# Altium project Nixie_Tube_Clock_Rev1.PrjPcb
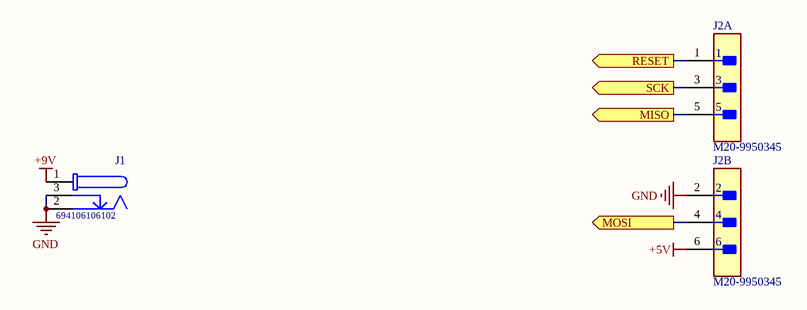
[diagram p0: Connectors.SchDoc]
6 sheets, 63 parts. Net scope: flat (ports and power ports of the same name join across sheets).
Board file: HV_Boost.PcbDoc
Sheets:
  Connectors.SchDoc
  LTC3862-2.SchDoc
  IN_12A.SchDoc
  ATMega1284p.SchDoc
  TPS5402.SchDoc
  Buttons.SchDoc

## Sheet Connectors.SchDoc
size A; SheetNumber: 1; SheetTotal: 6

### Parts
J1  694106106102  [694106106102]
J2  M20-9950345  [FP-M20-9950345-MFG]  (parts A,B of 2)

### Ports
MISO (out), MOSI (out), RESET (out), SCK (out)

### Nets
+5V: J2.6
+9V: J1.1
GND: J1.2 J1.3 J2.2
NetJ2_1: J2.1 ; port RESET
NetJ2_3: J2.3 ; port SCK
NetJ2_4: J2.4 ; port MOSI
NetJ2_5: J2.5 ; port MISO

### Library data of the parts
J1 = CMP-1502-00177-1: DC Power Jack Connector with 4 soldering pads & Pegs WR-DC, Male, Right Angled, SMT, 5 A, 24 V; Manufacturer: Wurth Elektronik; Working Voltage: 24V; Rated Current: 5A; Plug Inner Diameter: 2.05mm; Plug Outer Diameter: 5.5mm; Opening Diameter: 6.4mm; Packaging: TapeandReel; Package Reference: 694106106102; Datasheet URL: http://katalog.we-online.de/em/datasheet/6941xx106102.pdf; Operating Temperature: -40to85degC; Orientation: RightAngled; Part Number: 694106106102; Mounting Technology: SMT; Publisher: WurthElektronik; Manufacturer URL: http://www.we-online.de; Gender: Male
J2 = CMP-15831-000002-1: CONN HEADER R/A 6POS 2.54MM; Manufacturer: Harwin; Conn Gender: Male; Number Of Contacts: 6; Conn Orientation: Right Angle; Current Rating: 3A; Description: 6 Positions Header, Unshrouded, Breakaway Connector 0.100" (2.54mm) Through Hole, Right Angle Gold; Device Class L2: Headers and Wire Housings; Temperature: -40°C to +105°C; Device Class L1: Connectors; RoHS: TRUE; Temperature Range Low: -40°C; ComponentLink2URL: https://cdn.harwin.com/pdfs/M20-995.pdf; Height: 5.28mm; Digikey Description: CONN HEADER R/A 6POS 2.54MM; Pitch: 2.54mm; Manufacturer Part Number: M20-9950345; Device Class L3: unset; Ipc Land Pattern Name: DFN400X400X80-14; Automotive: No; Octopart: https://octopart.com/m20-9950345-harwin-21265213; Category: Conn; Mouser Description: Headers & Wire Housings 03+03 DIL HORIZONTAL PIN HEADER GOLD HT; Package: 0; Number Of Rows: 2; Contact Material: Gold,Nickel; Lead Free: Yes; ComponentLink2Description: Datasheet; Temperature Range High: +105°C

## Sheet LTC3862-2.SchDoc
size 431 x 279 mm; SheetNumber: 2; SheetTotal: 4
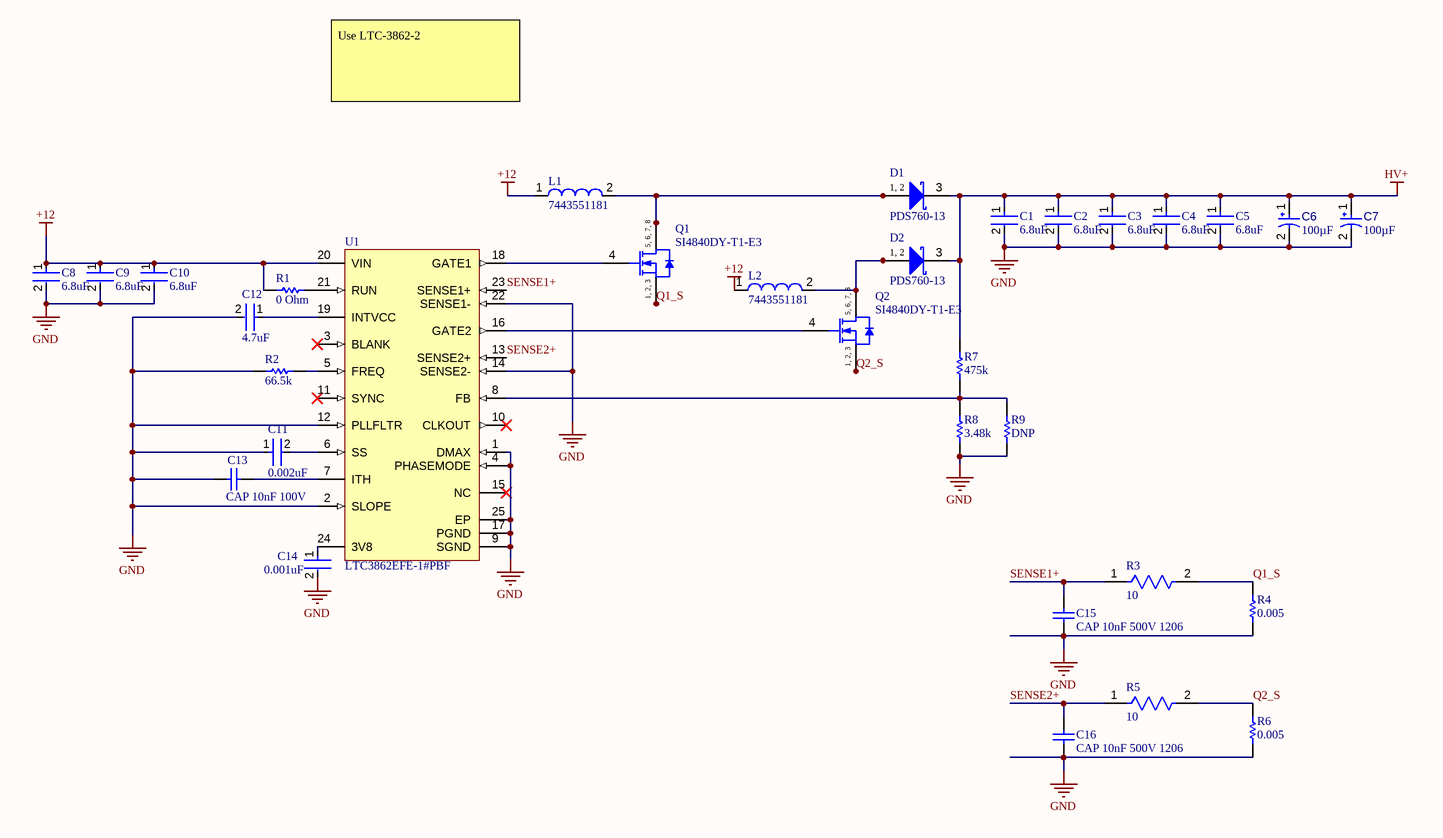
[diagram p1: LTC3862-2.SchDoc]

### Parts
C1  6.8uF  [FP-C3216-160-0_2-MFG]
C2  6.8uF  [FP-C3216-160-0_2-MFG]
C3  6.8uF  [FP-C3216-160-0_2-MFG]
C4  6.8uF  [FP-C3216-160-0_2-MFG]
C5  6.8uF  [FP-C3216-160-0_2-MFG]
C6  value 100µF  [CAPPR65-500-1600X1000X1700]  (hidden comment: ECA-2DM101)
C7  value 100µF  [CAPPR65-500-1600X1000X1700]  (hidden comment: ECA-2DM101)
C8  6.8uF  [FP-C3216-160-0_2-IPC_B]
C9  6.8uF  [FP-C3216-160-0_2-IPC_B]
C10  6.8uF  [FP-C3216-160-0_2-IPC_B]
C11  0.002uF  [FP-C1206C-EB-MFG]
C12  4.7uF  [FP-GRM31C-0_2-e0_3_0_8-IPC_C]
C13  CAP 10nF 100V  [CAPC1206(3216)170_N]
C14  0.001uF  [FP-C1206C-EB-MFG]
C15  CAP 10nF 500V 1206  [CAPC1206(3216)170_N]
C16  CAP 10nF 500V 1206  [CAPC1206(3216)170_N]
D1  PDS760-13  [DIOD-POWERDI5-3_V]
D2  PDS760-13  [DIOD-POWERDI5-3_V]
L1  7443551181  [WE-HCI-1365]
L2  7443551181  [WE-HCI-1365]
Q1  SI4840DY-T1-E3  [VISH-SOIC-8_A_V]
Q2  SI4840DY-T1-E3  [VISH-SOIC-8_A_V]
R1  0 Ohm  [RESC3216X89X64LL25T25]
R2  66.5k  [RESC3216X70X50NL05T20]
R3  10  [FP-CRCW1206-e3-IPC_A]
R4  0.005  [RESC3216X89X64LL25T25]
R5  10  [FP-CRCW1206-e3-IPC_A]
R6  0.005  [RESC3216X89X64LL25T25]
R7  475k  [RESC3216X60X45LL10T20]
R8  3.48k  [RESC3216X70X50LL05T20]
R9  DNP  [RESC3216X70X50LL05T20]
U1  LTC3862EFE-1#PBF  [LT-FE-24-EPV-AA_M]

### Nets
+12: C8.1 C9.1 C10.1 L1.1 L2.1 R1.1 U1.20(VIN)
GND: C1.2 C2.2 C3.2 C4.2 C5.2 C6.2 C7.2 C8.2 C9.2 C10.2 C11.1 C12.2 C13.2 C14.2 C15.2 C16.2 R2.1 R4.1 R6.1 R8.1 R9.1 U1.1(DMAX) U1.2(SLOPE) U1.4(PHASEMODE) U1.9(SGND) U1.12(PLLFLTR) U1.14(SENSE2-) U1.17(PGND) U1.22(SENSE1-) U1.25(EP)
HV+: C1.1 C2.1 C3.1 C4.1 C5.1 C6.1 C7.1 D1.3(K) D2.3(K) R7.2
Q1_S: Q1.1(S) Q1.2(S) Q1.3(S) R3.2 R4.2
Q2_S: Q2.1(S) Q2.2(S) Q2.3(S) R5.2 R6.2
SENSE1+: C15.1 R3.1 U1.23(SENSE1+)
SENSE2+: C16.1 R5.1 U1.13(SENSE2+)
NetC11_2: C11.2 U1.6(SS)
NetC12_1: C12.1 U1.19(INTVCC)
NetC13_1: C13.1 U1.7(ITH)
NetC14_1: C14.1 U1.24(3V8)
NetD1_1: D1.1(A) D1.2(A) L1.2 Q1.5(D) Q1.6(D) Q1.7(D) Q1.8(D)
NetD2_1: D2.1(A) D2.2(A) L2.2 Q2.5(D) Q2.6(D) Q2.7(D) Q2.8(D)
NetQ1_4: Q1.4(G) U1.18(GATE1)
NetQ2_4: Q2.4(G) U1.16(GATE2)
NetR1_2: R1.2 U1.21(RUN)
NetR2_2: R2.2 U1.5(FREQ)
NetR7_1: R7.1 R8.2 R9.2 U1.8(FB)

Not connected (* = marked no-connect by the designer): U1 3(BLANK)* 10(CLKOUT)* 11(SYNC)* 15(NC)*

### Notes on the sheet
- Use LTC-3862-2
- DWG. NO.
- REV.
- SHT.
- THIS DOCUMENT AND THE DATA DISCLOSED HEREIN OR HEREWITH IS THE PROPERTY OF ALTIUM LIMITED AND MAY BE FREELY DISTRIBUTED IN WHOLE. NO RIGHTS ARE RESERVED OR EXPRESS OR IMPLIED WARANTEE GIVEN.
- REVISION
- DESCRIPTION
- DATE
- APPROVED
- ENG:
- APPROVALS
- PROJECT
- DSN:
- CHK:
- REFERENCE DOCUMENTS
- PROJECT REVISION:
- TITLE
- DOCUMENT REVISION:
- DESIGN ITEM:
- BOM:
- FAB DWG:
- PCB DWG:
- ASSY DWG:
- SCALE:
- SIZE
- B
- CAGE CODE
- FILE NAME
- DWG NO.
- SHEET
- OF
- REV
- (in symbol CMP-2000-07056-1) 5, 6, 7, 8; 1, 2, 3
- (in symbol CMP-2000-07476-1) 1, 2

### Library data of the parts
C1-C5 = CMP-08246-003319-1: Multilayer Ceramic Capacitors 6.8uF ±20% 50V X5R SMD 1206 / C3216X5R1H685M160AB; Max Operating Temperature: 85°C; Min Operating Temperature: -55°C; Resistor Type: Ceramic; Thickness: 0.071inch; Capacitance: 6.8uF; Voltage Rating (DC): 50V; Length: 3.2mm; RoHS Compliant: Yes; Case/Package: 1206; Case Code (Metric): 3216; Series: C; Termination: SMD/SMT; Package Quantity: 1; Dielectric Material: Ceramic; Depth: 1.6mm; Mount: Surface Mount; Height: 1.6mm; Dielectric: X5R; Weight: 0.000571oz; Packaging: Tape and Reel; Lead Free: Lead Free; Tolerance: 20%; Construction: Flat; Width: 0.063inch; Case Code (Imperial): 1206; Voltage Rating: 50V
C6 C7 = CMP-001-00034-5: Aluminum Electrolytic Capacitor, 100 uF, +/- 20%, 200 V, -40 to 85 degC, 2-Pin THD, RoHS, Bulk; Manufacturer: Panasonic; Voltage Rating: 100V; Ripple Current (AC): 350mA; Mounting Technology: TH; RoHS Compliant: True; Package Reference: CAPPR65-500-1600X1000X1700; Lead Pitch: 5mm; Manufacturer URL: http://www.panasonic.com/; Min Operating Temperature: -40°C; Package Quantity: 200; Capacitor Type: Electrolytic; Diameter: 10mm; Packaging: Bulk; Datasheet URL: https://industrial.panasonic.com/cdbs/www-data/pdf/RDF0000/ABA0000C1047.pdf; Max Operating Temperature: 85°C; Pins: 2; Case/Package: Radial; Package Description: 2-Pin Through Hole Device, Dia 10 mm, Body Length 16 mm; Ripple Current: 350mA; Tolerance: 20%; Datasheet Version: Mar-16
C8-C10 = CMP-08246-003250-1: Multilayer Ceramic Capacitors 6.8uF ±10% 25V X7R SMD 1206 / C3216X7R1E685K160AB; Series: C; Construction: Flat; Max Operating Temperature: 125°C; Height: 1.6mm; Depth: 1.6mm; REACH SVHC: No SVHC; Lead Free: Lead Free; Dielectric Material: Ceramic; Length: 3.2mm; Dielectric: X7R; RoHS Compliant: Yes; Package Quantity: 1; Number of Pins: 2; Termination: SMD/SMT; Capacitance: 6.8uF; Min Operating Temperature: -55°C; Voltage Rating: 25V; Tolerance: 10%; Width: 0.063inch; Case Code (Imperial): 1206; Mount: Surface Mount; Resistor Type: Ceramic; Packaging: Tape and Reel; Weight: 0.000571oz; Voltage Rating (DC): 25V; Case/Package: 1206; Thickness: 0.075inch; Case Code (Metric): 3216
C11 = CMP-1037-02760-2: C1206 2,000 pF C0G 5.00% 100 V / C1206C202J1GACTU; Manufacturer: KEMET; Voltage Rating: 100 V; Tolerance: 0.05; Temperature Coefficient: 15%; Material: Ceramic; Automotive Grade: Grade 0; ComponentLink2URL: https://content.kemet.com/datasheets/KEM_C1007_X8R_ULTRA_150C_SMD.pdf; Device Class L3: Ceramic Capacitors; Temperature Characteristic: C0G; Category: Cap; RoHS: TRUE; Mouser Description: Cap Ceramic 0.002uF 100V C0G 5% SMD 1206 125°C Plastic T/R; Temperature Range Low: -55°C; Device Class L2: Capacitors; Temperature: -55°C to +150°C; Temperature Range High: +150°C; Ipc Land Pattern Name: CAPC320160X78; ComponentLink2Description: Datasheet; Octopart: https://octopart.com/c1206c202j1gactu-kemet-16997314; Device Class L1: Passive Components; Capacitance: 2,000 pF; Automotive: Yes; Manufacturer Part Number: C1206C202J1GACTU; Package: C1206C-EB; Height: 0.88mm; Value: 2,000 pF; Lead Free: Yes
C12 = CMP-1037-04923-3: Chip Multilayer Ceramic Capacitors for General Purpose, 1206, 4.7uF, X7R, 15%, 10%, 50V; Height: 1.6mm; Voltage: 50V; Capacitance: 4.7uF; Lead Free: Lead Free; Max Operating Temperature: 125°C; Packaging: Tape and Reel; REACH SVHC: No SVHC; Voltage Rating: 50V; Mount: Surface Mount; Termination: SMD/SMT; Tolerance: 10%; Case/Package: 1206; Material: Ceramic; Depth: 1.6mm; Length: 3.2mm; Case Code (Metric): 3216; Voltage Rating (DC): 50V; Case Code (Imperial): 1206; Radiation Hardening: No; Width: 0.063inch; Thickness: 0.071inch; Package Quantity: 2000; Min Operating Temperature: -55°C; Dielectric: X7R
C13 = CMP-1037-03519-1: CAP 10nF 100V ±5% 1206 (3216 Metric) Thickness 1.7mm SMD; Tolerance: Â±5%; Case-EIA: 1206; Case-Metric: 3216; Rated Voltage: 100 V; Value: 10nF; Technology: SMT; Max Thickness: 1.7 mm
C14 = CMP-03020-027220-1: 1206 1000pF Ceramic Multilayer Capacitor; 50VDC; 125degC; C0G Dielec; +/-5% SMD / C1206C102J5GACTU; Manufacturer: KEMET; Value: 1,000 pF; Voltage Rating: 50 V; Temperature Coefficient: 15%; Automotive Grade: Grade 0; Tolerance: 0.05; RoHS: TRUE; Category: Cap; Manufacturer Part Number: C1206C102J5GACTU; Temperature Range Low: -55°C; Digikey Description: 1206 1000pF Ceramic Multilayer Capacitor; 50VDC; 125degC; C0G Dielec; +/-5% SMD; ComponentLink2URL: https://content.kemet.com/datasheets/KEM_C1007_X8R_ULTRA_150C_SMD.pdf; Device Class L1: Passive Components; Device Class L3: Ceramic Capacitors; Temperature Characteristic: C0G; ComponentLink2Description: Datasheet; Height: 0.88mm; Automotive: Yes; Mouser Description: Multilayer Ceramic Capacitors MLCC - SMD/SMT 50volts 1000pF C0G 5%; Material: Ceramic; Capacitance: 1,000 pF; Lead Free: Yes; Device Class L2: Capacitors; Octopart: https://octopart.com/c1206c102j5gactu-kemet-139939; Temperature: -55°C to +150°C; Temperature Range High: +150°C; Ipc Land Pattern Name: CAPC320160X78; Package: C1206C-EB
C15 C16 = CMP-1037-03540-1: CAP 10nF 500V ±10% 1206 (3216 Metric) Thickness 1.7mm SMD; Tolerance: Â±10%; Case-Metric: 3216; Case-EIA: 1206; Rated Voltage: 500 V; Value: 10nF; Max Thickness: 1.7 mm; Technology: SMT
D1 D2 = CMP-2000-07476-1: Schottky Barrier Rectifier, 60 V, 7 A, -65 to 150 degC, 3-Pin SMD, RoHS, Tape and Reel; Manufacturer: Diodes Inc; Max Repetitive Reverse Voltage (Vrrm): 60V; Element Configuration: CommonAnode; Max Forward Surge Current (Ifsm): 275A; Polarity: Standard; Forward Voltage: 620mV; Forward Current: 7A; Peak Reverse Current: 200uA; Case\/Package: SMD/SMT; Manufacturer URL: http://www.diodes.com/; Reverse Voltage (DC): 60V; Lead Free: LeadFree; Voltage Rating (DC): 60V; Min Operating Temperature: -65degC; Package Description: 3-Pin Surface Mount Device, Body 3.975 x 5.375 mm, Pitch 1.84 mm; Length: 4.05mm; Datasheet URL: https://www.diodes.com/assets/Datasheets/ds30477.pdf; REACH SVHC: NoSVHC; Peak Non-Repetitive Surge Current: 275A; Output Current: 7A; Contact Plating: Matte; Mounting Technology: SurfaceMount; Mount: SurfaceMount; RoHSCompliant: true; Weight: 0.003386oz; Current Rating: 7A; Max Operating Temperature: 150degC; Package Quantity: 5000; Height: 1.15mm; Average Rectified Current: 7A; Datasheet Version: Rev. 13-2, 10/2012; Number of Pins: 5; Width: 5.45mm; Packaging: TapeandReel; Radiation Hardening: No; Package Reference: POWERDI5-3
L1 L2 = CMP-1351-00013-1: SMD Flat Wire High Current Inductor WE-HCI, L=18.0 µH; Manufacturer: Wuerth Elektronik; Inductance: 18.0 ÂµH; ComponentLink2URL: http://katalog.we-online.de/kataloge/eisos/media/pdf/7443551181.pdf; ComponentLink1URL: http://www.we-online.com; PartNumber: 7443551181; ComponentLink2Description: Datasheet; ComponentLink1Description: Manufacturer URL; PackageReference: WE-HCI-1365; PackageDescription: Inductor, 2-Leads, Body 13.2 x 12.8 mm
Q1 Q2 = CMP-2000-07056-1: N-Channel MOSFET, 40 V, -55 to 150 degC, 8-Pin SOIC, RoHS, Tape and Reel; Manufacturer: Vishay; Channel Type: N; Typical Gate Charge @ Vgs: 18.5nCV@5; Maximum Power Dissipation: 1.56W; Typical Turn-On Delay Time: 15ns; Configuration: QuadDrain,Single,TripleSource; Channel Mode: Enhancement; Typical Turn-Off Delay Time: 50ns; Maximum Drain Source Resistance: 0.009; Number of Elements per Chip: 1; Maximum Gate Source Voltage: 20V; Maximum Continuous Drain Current: 10A; Maximum Drain Source Voltage: 40V; Height: 1.55mm; Category: PowerMOSFET; Maximum Operating Temperature: +150C; Width: 4mm; Length: 5mm; Datasheet Version: Rev. E, 05/2009; Mounting Type: SurfaceMount; Package Type: SOICN; Dimensions: 5x4x1.55mm; Minimum Operating Temperature: -55C; Package Description: 8-Pin Small Outline Integrated Circuit, Body 4.9 x 3.9 mm, Pitch 1.27 mm; Pin Count: 8; Package Reference: SOIC-8; Datasheet URL: http://www.vishay.com/docs/71188/71188.pdf; Package URL: http://www.vishay.com/docs/71192/71192.pdf; Mounting Technology: SurfaceMount; Manufacturer URL: http://www.vishay.com/
R1 = CMP-2003-04332-1: 0 ohm 1206 / WSL120600000ZEA9; Manufacturer: Vishay Dale; Part Number: WSL120600000ZEA9
R2 = CMP-2003-00464-1: ERJ-8ENF6652V; Manufacturer: Panasonic; Part Number: ERJ-8ENF6652V
R3 R5 = CMP-2003-04815-2: RES Thick Film, 10Ω, 1%, 0.25W, 100ppm/°C, 1206 / CRCW120610R0FKEA; Power Rating: 250mW; Voltage Rating (DC): 200V; Resistance: 10R; Number of Terminations: 2; Width: 0.063inch; Case Code (Imperial): 1206; Depth: 1.6mm; Contact Plating: Tin; Radiation Hardening: No; Lead Free: Lead Free; Length: 3.2mm; Tolerance: 1%; Max Power Dissipation: 250mW; Composition: Thick Film; Weight: 0.000353oz; Case/Package: 1206; Number of Pins: 2; Package Quantity: 10; Min Operating Temperature: -55°C; Military Standard: Not; Max Operating Temperature: 155°C; Termination: SMD/SMT; Case Code (Metric): 3216; Voltage Rating: 200V; Height: 0.55mm; Features: Automotive AEC-Q200; Temperature Coefficient: 100ppm/°C; Packaging: Tape and Reel
R4 R6 = CMP-2003-04338-1: WSLP12065L000FEA; Manufacturer: Vishay Dale; Part Number: WSLP12065L000FEA
R7 = CMP-2003-02210-1: CRCW1206475KFKEA; Manufacturer: Vishay Dale; Part Number: CRCW1206475KFKEA
R8 = CMP-2003-00318-1: ERJ-8ENF3481V; Manufacturer: Panasonic; Part Number: ERJ-8ENF3481V
R9 = CMP-2003-00318-1: Manufacturer: Panasonic; Part Number: ERJ-8ENF3481V
U1 = CMP-0492-00585-1: Multi-Phase Current Mode Step-Up DC/DC Controller, 10 V IntVcc, 7.5 V UV+, 7 V UV-, 24-pin SOP (FE-24-EPV-AA), -40 to 125 degC, Pb-Free; Manufacturer: Linear Technology; Frequency Sync Range: 50kHz - 650kHz; Number of Outputs: 1; ComponentLink2Description: Datasheet; PackageReference: FE-24; ComponentLink3URL: http://cds.linear.com/docs/en/packaging/TSSOP_24_05-08-1771.pdf; ComponentLink3Description: Package Specification; Mounting Technology: Surface Mount; ComponentLink2URL: http://cds.linear.com/docs/en/datasheet/38621f.pdf; PartNumber: LTC3862EFE-1#PBF; RoHS: TRUE; ComponentLink1Description: Manufacturer URL; ComponentLink1URL: http://www.linear.com/; PackageVersion: Rev. B, 09/2010; PackageDescription: 24-Pin Plastic TSSOP, Body 7.8 x 4.4 mm, Pitch 0.65 mm

## Sheet IN_12A.SchDoc
size 431 x 279 mm; SheetNumber: 3; SheetTotal: 6
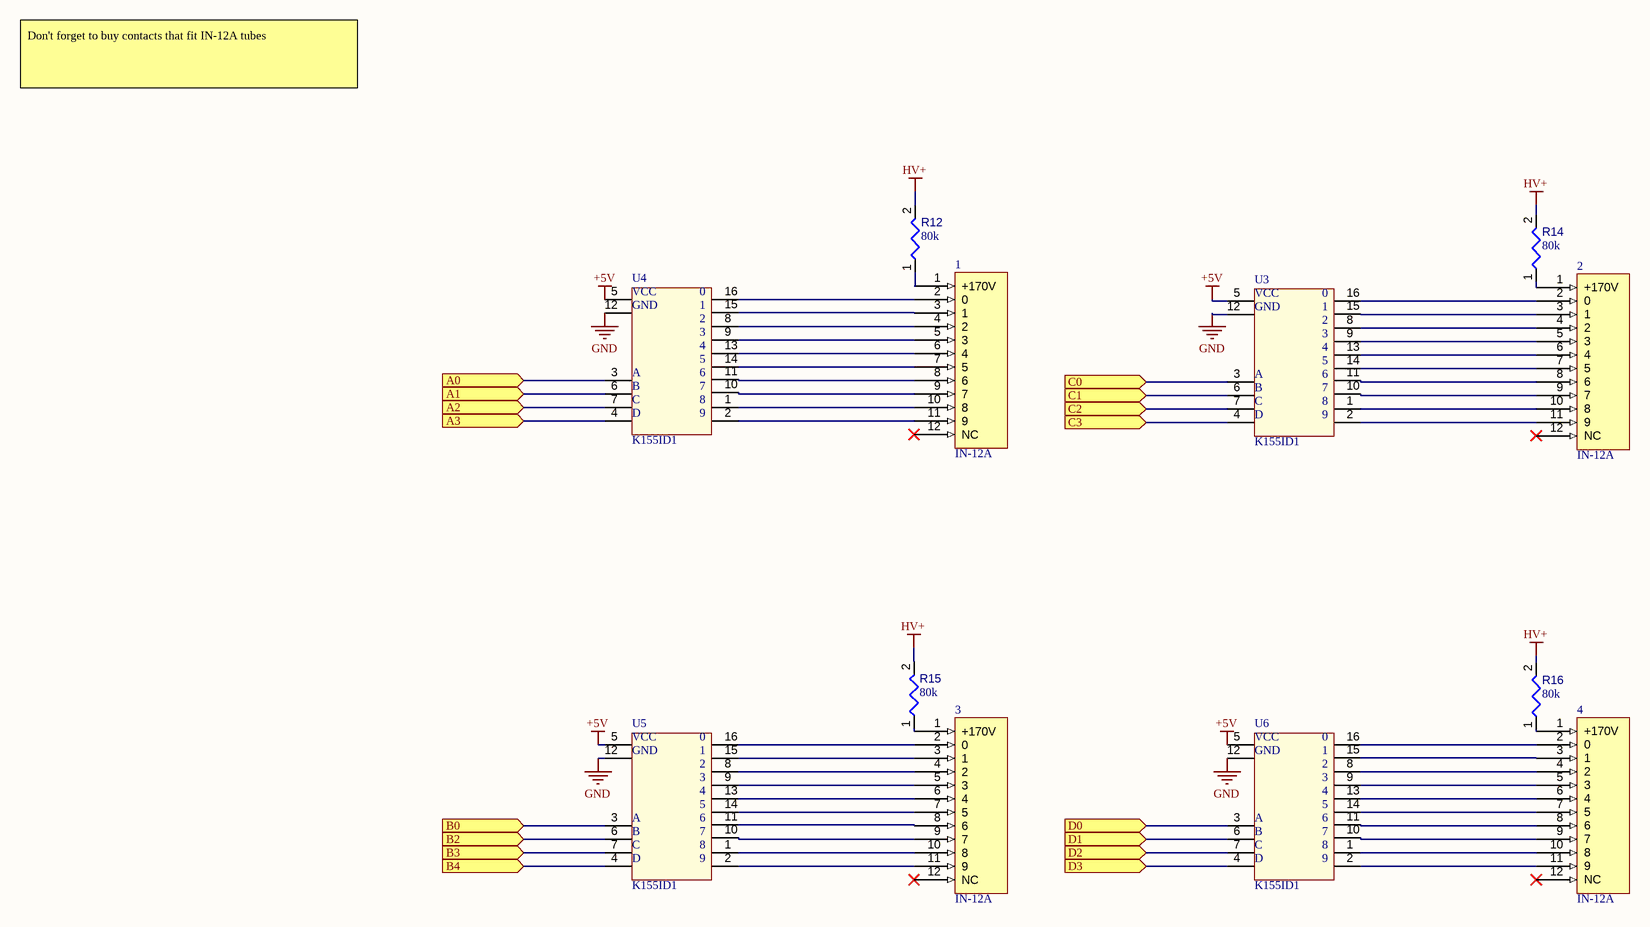
[diagram p2: IN_12A.SchDoc]

### Parts
1  IN-12A  [IN-12A]
2  IN-12A  [IN-12A]
3  IN-12A  [IN-12A]
4  IN-12A  [IN-12A]
R12  value 80k  [RESC3216X60X45ML15T20]  (hidden comment: Resistor 80k +/-1% 1206 250 mW)
R14  value 80k  [RESC3216X60X45ML15T20]  (hidden comment: Resistor 80k +/-1% 1206 250 mW)
R15  value 80k  [RESC3216X60X45ML15T20]  (hidden comment: Resistor 80k +/-1% 1206 250 mW)
R16  value 80k  [RESC3216X60X45ML15T20]  (hidden comment: Resistor 80k +/-1% 1206 250 mW)
U3  K155ID1  [Socket_DIP_16]
U4  K155ID1  [Socket_DIP_16]
U5  K155ID1  [Socket_DIP_16]
U6  K155ID1  [Socket_DIP_16]

### Ports
A0 (in), A1 (in), A2 (in), A3 (in), B0 (in), B2 (in), B3 (in), B4 (in), C0 (in), C1 (in), C2 (in), C3 (in), D0 (in), D1 (in), D2 (in), D3 (in)

### Nets
+5V: U3.5 U4.5 U5.5 U6.5
GND: U3.12 U4.12 U5.12 U6.12
HV+: R12.2 R14.2 R15.2 R16.2
Net1_1: 1.1(+170V) R12.1
Net1_2: 1.2(0) U4.16
Net1_3: 1.3(1) U4.15
Net1_4: 1.4(2) U4.8
Net1_5: 1.5(3) U4.9
Net1_6: 1.6(4) U4.13
Net1_7: 1.7(5) U4.14
Net1_8: 1.8(6) U4.11
Net1_9: 1.9(7) U4.10
Net1_10: 1.10(8) U4.1
Net1_11: 1.11(9) U4.2
Net2_1: 2.1(+170V) R14.1
Net2_2: 2.2(0) U3.16
Net2_3: 2.3(1) U3.15
Net2_4: 2.4(2) U3.8
Net2_5: 2.5(3) U3.9
Net2_6: 2.6(4) U3.13
Net2_7: 2.7(5) U3.14
Net2_8: 2.8(6) U3.11
Net2_9: 2.9(7) U3.10
Net2_10: 2.10(8) U3.1
Net2_11: 2.11(9) U3.2
Net3_1: 3.1(+170V) R15.1
Net3_2: 3.2(0) U5.16
Net3_3: 3.3(1) U5.15
Net3_4: 3.4(2) U5.8
Net3_5: 3.5(3) U5.9
Net3_6: 3.6(4) U5.13
Net3_7: 3.7(5) U5.14
Net3_8: 3.8(6) U5.11
Net3_9: 3.9(7) U5.10
Net3_10: 3.10(8) U5.1
Net3_11: 3.11(9) U5.2
Net4_1: 4.1(+170V) R16.1
Net4_2: 4.2(0) U6.16
Net4_3: 4.3(1) U6.15
Net4_4: 4.4(2) U6.8
Net4_5: 4.5(3) U6.9
Net4_6: 4.6(4) U6.13
Net4_7: 4.7(5) U6.14
Net4_8: 4.8(6) U6.11
Net4_9: 4.9(7) U6.10
Net4_10: 4.10(8) U6.1
Net4_11: 4.11(9) U6.2
NetU3_3: U3.3 ; port C0
NetU3_4: U3.4 ; port C3
NetU3_6: U3.6 ; port C1
NetU3_7: U3.7 ; port C2
NetU4_3: U4.3 ; port A0
NetU4_4: U4.4 ; port A3
NetU4_6: U4.6 ; port A1
NetU4_7: U4.7 ; port A2
NetU5_3: U5.3 ; port B0
NetU5_4: U5.4 ; port B4
NetU5_6: U5.6 ; port B2
NetU5_7: U5.7 ; port B3
NetU6_3: U6.3 ; port D0
NetU6_4: U6.4 ; port D3
NetU6_6: U6.6 ; port D1
NetU6_7: U6.7 ; port D2

Not connected (* = marked no-connect by the designer): 1 12(NC)*; 2 12(NC)*; 3 12(NC)*; 4 12(NC)*

### Notes on the sheet
- Don't forget to buy contacts that fit IN-12A tubes
- DWG. NO.
- REV.
- SHT.
- THIS DOCUMENT AND THE DATA DISCLOSED HEREIN OR HEREWITH IS THE PROPERTY OF ALTIUM LIMITED AND MAY BE FREELY DISTRIBUTED IN WHOLE. NO RIGHTS ARE RESERVED OR EXPRESS OR IMPLIED WARANTEE GIVEN.
- REVISION
- DESCRIPTION
- DATE
- APPROVED
- ENG:
- APPROVALS
- PROJECT
- DSN:
- CHK:
- REFERENCE DOCUMENTS
- PROJECT REVISION:
- TITLE
- DOCUMENT REVISION:
- DESIGN ITEM:
- BOM:
- FAB DWG:
- PCB DWG:
- ASSY DWG:
- SCALE:
- SIZE
- B
- CAGE CODE
- FILE NAME
- DWG NO.
- SHEET
- OF
- REV
- (in symbol K155ID1) VCC; 0; GND; A; B; C; D

### Library data of the parts
R12 R14-R16 = CMP-009-00016-4: Chip Resistor, 80 KOhm, +/- 1%, 0.25 W, -55 to 155 degC, 1206 (3216 Metric); Power: 250mW; Voltage Rating: 200V; Max Operating Temperature: 155°C; Mounting Technology: SM; Case/Package: 1206; Pins: 2; Min Operating Temperature: -55°C; RoHS Compliant: True; Tolerance: 1%

## Sheet ATMega1284p.SchDoc
size A; SheetNumber: 4; SheetTotal: 6
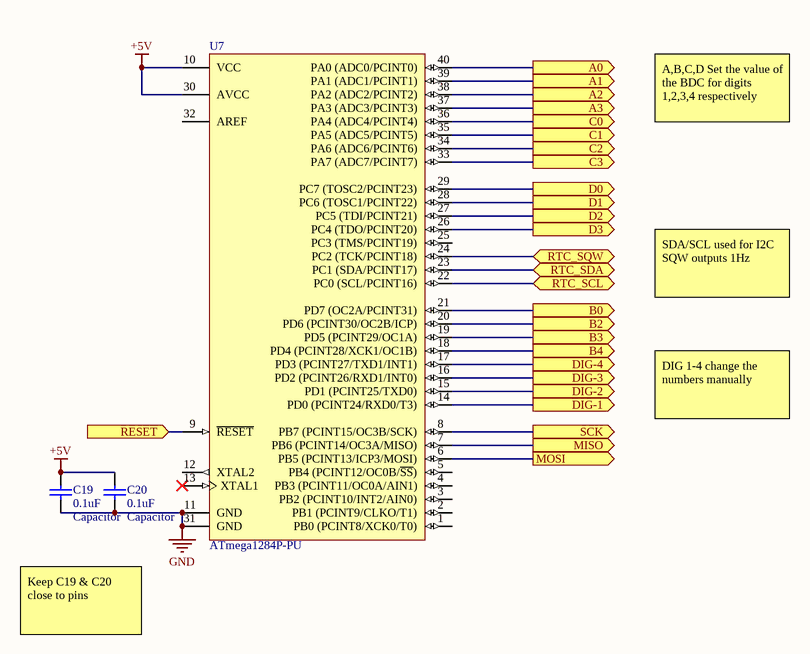
[diagram p3: ATMega1284p.SchDoc]

### Parts
C19  value 0.1uF  Type: Capacitor  [FOOTPRINT-1206-GEN]  (hidden comment: Capacitor - 0.1uF - 1206)
C20  value 0.1uF  Type: Capacitor  [FOOTPRINT-1206-GEN]  (hidden comment: Capacitor - 0.1uF - 1206)
U7  ATmega1284P-PU  [40P6]

### Ports
A0 (out), A1 (out), A2 (out), A3 (out), B0 (out), B2 (out), B3 (out), B4 (out), C0 (out), C1 (out), C2 (out), C3 (out), D0 (out), D1 (out), D2 (out), D3 (out), DIG-1 (out), DIG-2 (out), DIG-3 (out), DIG-4 (out), MISO (out), MOSI (out), RESET (in), RTC_SCL (bidir), RTC_SDA (bidir), RTC_SQW (bidir), SCK (out)

### Nets
+5V: C19.2 C20.2 U7.10(VCC) U7.30(AVCC)
GND: C19.1 C20.1 U7.11(GND) U7.31(GND)
NetJ2_1: U7.9(~{RESET}) ; port RESET
NetJ2_3: U7.8(PB7_(PCINT15/OC3B/SCK)) ; port SCK
NetJ2_4: U7.6(PB5_(PCINT13/ICP3/MOSI)) ; port MOSI
NetJ2_5: U7.7(PB6_(PCINT14/OC3A/MISO)) ; port MISO
NetSW1_3: U7.14(PD0_(PCINT24/RXD0/T3)) ; port DIG-1
NetSW2_3: U7.15(PD1_(PCINT25/TXD0)) ; port DIG-2
NetSW3_3: U7.16(PD2_(PCINT26/RXD1/INT0)) ; port DIG-3
NetSW4_3: U7.17(PD3_(PCINT27/TXD1/INT1)) ; port DIG-4
NetU3_3: U7.36(PA4_(ADC4/PCINT4)) ; port C0
NetU3_4: U7.33(PA7_(ADC7/PCINT7)) ; port C3
NetU3_6: U7.35(PA5_(ADC5/PCINT5)) ; port C1
NetU3_7: U7.34(PA6_(ADC6/PCINT6)) ; port C2
NetU4_3: U7.40(PA0_(ADC0/PCINT0)) ; port A0
NetU4_4: U7.37(PA3_(ADC3/PCINT3)) ; port A3
NetU4_6: U7.39(PA1_(ADC1/PCINT1)) ; port A1
NetU4_7: U7.38(PA2_(ADC2/PCINT2)) ; port A2
NetU5_3: U7.21(PD7_(OC2A/PCINT31)) ; port B0
NetU5_4: U7.18(PD4_(PCINT28/XCK1/OC1B)) ; port B4
NetU5_6: U7.20(PD6_(PCINT30/OC2B/ICP)) ; port B2
NetU5_7: U7.19(PD5_(PCINT29/OC1A)) ; port B3
NetU6_3: U7.29(PC7_(TOSC2/PCINT23)) ; port D0
NetU6_4: U7.26(PC4_(TDO/PCINT20)) ; port D3
NetU6_6: U7.28(PC6_(TOSC1/PCINT22)) ; port D1
NetU6_7: U7.27(PC5_(TDI/PCINT21)) ; port D2
NetU7_22: U7.22(PC0_(SCL/PCINT16)) ; port RTC_SCL
NetU7_23: U7.23(PC1_(SDA/PCINT17)) ; port RTC_SDA
NetU7_24: U7.24(PC2_(TCK/PCINT18)) ; port RTC_SQW

Not connected (* = marked no-connect by the designer): U7 1(PB0_(PCINT8/XCK0/T0)) 2(PB1_(PCINT9/CLKO/T1)) 3(PB2_(PCINT10/INT2/AIN0)) 4(PB3_(PCINT11/OC0A/AIN1)) 5(PB4_(PCINT12/OC0B/~{SS})) 12(XTAL2) 13(XTAL1)* 25(PC3_(TMS/PCINT19)) 32(AREF)

### Notes on the sheet
- A,B,C,D Set the value of the BDC for digits 1,2,3,4 respectively
- SDA/SCL used for I2C
  SQW outputs 1Hz
- DIG 1-4 change the numbers manually
- Keep C19 & C20 close to pins

### Library data of the parts
C19 C20 = CMP-001-00096-1: CAP CER 0.1UF 50V X7R 1206; Part Number: 1276-7034-1-ND; PackageReference: RAD-0.3; Published: 8-Jun-2000; Source: Generic.SchLib; Design Item ID: Capacitor-Generic-1206; LatestRevisionNote: Re-released for DXP Platform.; PackageDescription: Radial Cap, Thru-Hole; 2 Leads; 0.3 in Pin Spacing; Publisher: Altium Limited
U7 = CMP-0107-00007-2: 8-bit AVR Microcontroller, 128KB Flash, 4KB EEPROM, 16KB SRAM, 40-pin PDIP, Industrial Grade (-40°C to 85°C); ComponentLink2Description: ATmega164A/164PA/324A/324PA/644A/644PA/1284/1284P Datasheet; PackageReference: 40P6; PackageVersion: revB, Sep-2001; PackageDescription: 40-lead (0.600"/15.24mm Wide) Plastic Dual Inline Package (PDIP); Code_JEDEC: MS-011-AC; ComponentLink1Description: Manufacturer URL; ComponentLink3Description: ATmega164A/164PA/324A/324PA/644A/644PA/1284/1284P Summary; ComponentLink3URL: http://www.atmel.com/dyn/resources/prod_documents/8272S.pdf; DatasheetVersion: revC, Jun-2011; ComponentLink2URL: http://www.atmel.com/dyn/resources/prod_documents/doc8272.pdf; ComponentLink1URL: http://www.atmel.com/

## Sheet TPS5402.SchDoc
size A; SheetNumber: 5; SheetTotal: 7
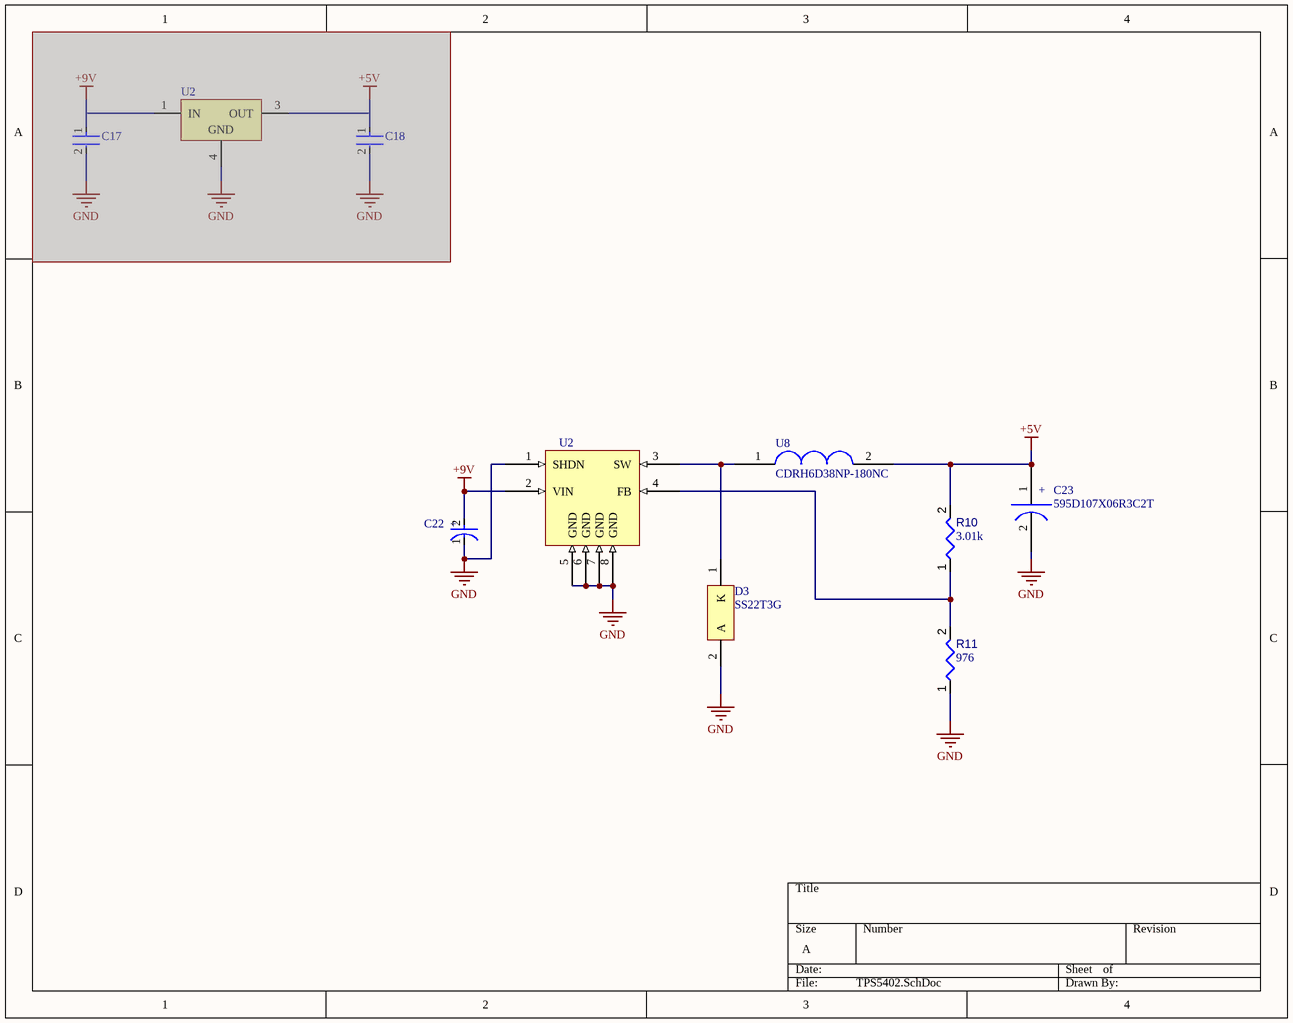
[diagram p4: TPS5402.SchDoc]

### Parts
(Parts that share a designator on the sheet are numbered #1, #2 ... from top to bottom, then left to right.)
C17  C1206C334K1RACTU  [FP-C1206C-EB-MFG]  (value not drawn)  (masked out: inside a compile mask, not in the netlist)
C18  C1206C104K1RACTU  [FP-C1206C-EB-MFG]  (value not drawn)  (masked out: inside a compile mask, not in the netlist)
C22  47uF  [FP-T528Z477M2R5ATE008-MFG]  (value not drawn)
C23  595D107X06R3C2T  [595D107X06R3C2T]
D3  SS22T3G  [ONSC-SMB-2-403A-03_V]
R10  value 3.01k  [RESC3216X60X45ML15T20]  (hidden comment: Resistor 3.01k +/-1% 1206 250 mW)
R11  value 976  [RESC3216X60X45ML15T20]  (hidden comment: Resistor 976 +/-1% 1206 250 mW)
U2#1  L7805CD2T-TR  [TO-263_M]  (value not drawn)  (masked out: inside a compile mask, not in the netlist)
U2#2  MIC4690YM-TR  [TPS5402]  (value not drawn)
U8  CDRH6D38NP-180NC  [CDRH6D38NP-180NC]

### Nets
+5V: C23.1 R10.2 U8.2
+9V: C22.2(A) U2#2.2(VIN)
GND: C22.1(C) C23.2 D3.2(A) R11.1 U2#2.1(SHDN) U2#2.5(GND) U2#2.6(GND) U2#2.7(GND) U2#2.8(GND)
NetD3_1: D3.1(K) U2#2.3(SW) U8.1
NetR10_1: R10.1 R11.2 U2#2.4(FB)

### Notes on the sheet
- (in symbol 595D107X06R3C2T) +
- (in symbol CMP-03017-000005-1) +

### Library data of the parts
C17 = CMP-1037-04498-2: CAP CER 0.33UF 100V X7R 1206 / C1206C334K1RACTU; Manufacturer: KEMET; Material: Ceramic; Value: 0.33 μF; Automotive Grade: Grade 0; Temperature Coefficient: 15%; Tolerance: 0.1; Voltage Rating: 100 V; Height: 0.88mm; Device Class L1: Passive Components; Device Class L2: Capacitors; Package: C1206C-EB; Lead Free: Yes; Mouser Description: Cap Ceramic 0.33uF 100V X7R 10% SMD 1206 125°C Plastic T/R; ComponentLink2URL: https://content.kemet.com/datasheets/KEM_C1007_X8R_ULTRA_150C_SMD.pdf; Digikey Description: CAP CER 0.33UF 100V X7R 1206; Category: Cap; Automotive: Yes; Temperature Range Low: -55°C; Ipc Land Pattern Name: CAPC320160X78; Manufacturer Part Number: C1206C334K1RACTU; Temperature: -55°C to +150°C; Temperature Range High: +150°C; RoHS: TRUE; Device Class L3: Ceramic Capacitors; Octopart: https://octopart.com/c1206c334k1ractu-kemet-9144123; Capacitance: 0.33 μF; Temperature Characteristic: X7R; ComponentLink2Description: Datasheet
C18 = CMP-03020-000153-1: CAP CER 0.1UF 100V X7R 1206 / C1206C104K1RACTU; Manufacturer: KEMET; Value: 0.10 μF; Tolerance: 0.1; Material: Ceramic; Temperature Coefficient: 15%; Automotive Grade: Grade 0; Voltage Rating: 100 V; Automotive: Yes; Ipc Land Pattern Name: CAPC320160X78; Device Class L1: Passive Components; ComponentLink2Description: Datasheet; Temperature Range Low: -55°C; Category: Cap; Octopart: https://octopart.com/c1206c104k1ractu-kemet-89521; Height: 0.88mm; Lead Free: Yes; Digikey Description: CAP CER 0.1UF 100V X7R 1206; Mouser Description: CAP CER 0.1UF 100V X7R 1206; Device Class L3: Ceramic Capacitors; Device Class L2: Capacitors; ComponentLink2URL: https://content.kemet.com/datasheets/KEM_C1007_X8R_ULTRA_150C_SMD.pdf; Temperature Range High: +150°C; Temperature Characteristic: X7R; Manufacturer Part Number: C1206C104K1RACTU; RoHS: TRUE; Capacitance: 0.10 μF; Package: C1206C-EB; Temperature: -55°C to +150°C
C22 = CMP-03017-000005-1: CAP TANT 47UF 20% 20V 2917 / 595D476X0020D2T; Voltage Rating (DC): 2.5V; Ripple Current: 6.4A; Dissipation Factor: 10%; ESR (Equivalent Series Resistance): 8mR; Capacitance: 470uF; Leakage Current: 118uA; Polarity: Polar; Max Operating Temperature: 105°C; RoHS Compliant: Yes; Mount: Surface Mount; Depth: 4.3mm; Voltage Rating: 2.5V; Width: 0.169inch; Package Quantity: 1; Height: 1.7mm; Packaging: Tape and Reel; Features: General Purpose; Termination: SMD/SMT; Case/Package: 2917; Min Operating Temperature: -55°C; Height - Seated (Max): 0.067inch; Case Code (Imperial): 2917; Case Code (Metric): 7343; Length: 7.3mm; Construction: Flat; Series: KO-CAP T528; Tolerance: 20%; REACH SVHC: No SVHC
C23 = 595D107X06R3C2T: 595D107X06R3C2T / 100uF, 6.3V
D3 = CMP-1055-00373-1: Schottky Power Rectifier, 2-Pin SMB, Pb-Free, Tape and Reel; Manufacturer: On Semiconductor; IFSM Max (A): 75; Configuration: Single; DatasheetVersion: Rev. 4; PackageVersion: Rev. J, 07/2012; ComponentLink3Description: Package Specification; ComponentLink2Description: Datasheet; PackageDescription: 2-Pin Small Molded Package, J-Bend Lead, Body 4.33 x 3.625 mm; Mounting Technology: Surface Mount; PartNumber: SS22T3G; ComponentLink3URL: http://www.onsemi.com/pub_link/Collateral/403A-03.PDF; Packing: Tape and Reel; ComponentLink1URL: http://www.onsemi.com/; ComponentLink2URL: http://www.onsemi.cn/pub_link/Collateral/SS24-D.PDF; PackageReference: SMB-2-403A-03; RoHS: TRUE; ComponentLink1Description: Manufacturer URL
R10 = CMP-009-00016-4: Chip Resistor, 3.01KOhm, +/- 1%, 0.25 W, -55 to 155 degC, 1206 (3216 Metric); Power: 250mW; Voltage Rating: 200V; Max Operating Temperature: 155°C; Mounting Technology: SM; Case/Package: 1206; Pins: 2; Min Operating Temperature: -55°C; RoHS Compliant: True; Tolerance: 1%
R11 = CMP-009-00016-4: Chip Resistor, 976Ohm, +/- 1%, 0.25 W, -55 to 155 degC, 1206 (3216 Metric); Power: 250mW; Voltage Rating: 200V; Max Operating Temperature: 155°C; Mounting Technology: SM; Case/Package: 1206; Pins: 2; Min Operating Temperature: -55°C; RoHS Compliant: True; Tolerance: 1%
U2#1 = CMP-0244-00213-1: Positive Voltage Regulator, 3-Pin D2PAK, Tape and Reel / L7805CD2T-TR; PackageReference: TO-263; ComponentLink2URL: http://www.st.com/internet/com/TECHNICAL_RESOURCES/TECHNICAL_LITERATURE/DATASHEET/CD00000444.pdf; PackageDescription: 3-Pin Transistor Outline Package 2.54 mm Pitch, 15.4 mm Lead Span (D2PAK); DatasheetVersion: 16/11/2011; ComponentLink2Description: Datasheet; ComponentLink1Description: Manufacturer URL; PackageVersion: 2011; ComponentLink1URL: http://www.st.com

## Sheet Buttons.SchDoc
size A; SheetNumber: 6; SheetTotal: 6
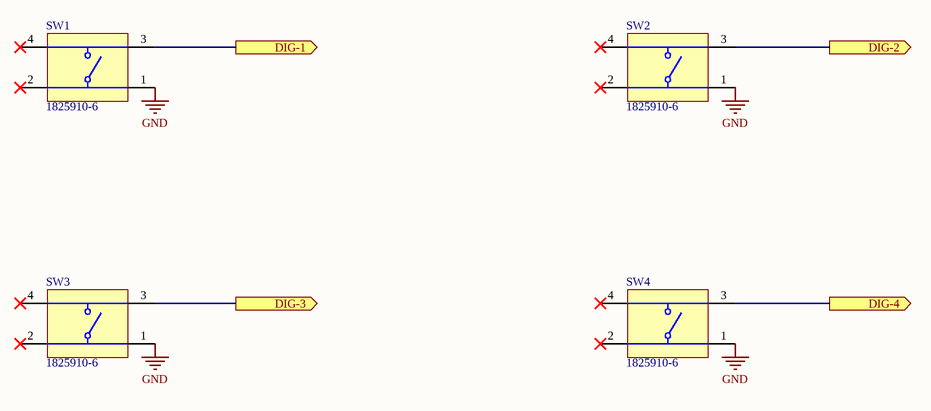
[diagram p5: Buttons.SchDoc]

### Parts
SW1  1825910-6  [TECO-1825910-6_V]
SW2  1825910-6  [TECO-1825910-6_V]
SW3  1825910-6  [TECO-1825910-6_V]
SW4  1825910-6  [TECO-1825910-6_V]

### Ports
DIG-1 (out), DIG-2 (out), DIG-3 (out), DIG-4 (out)

### Nets
GND: SW1.1 SW2.1 SW3.1 SW4.1
NetSW1_3: SW1.3 ; port DIG-1
NetSW2_3: SW2.3 ; port DIG-2
NetSW3_3: SW3.3 ; port DIG-3
NetSW4_3: SW4.3 ; port DIG-4

Not connected (* = marked no-connect by the designer): SW1 2* 4*; SW2 2* 4*; SW3 2* 4*; SW4 2* 4*

### Library data of the parts
SW1-SW4 = CMP-1684-00021-1: Tact Switch, SPST-NO, 0.05 A, -35 to 85 degC, 4-Pin THD, RoHS, Bulk; Manufacturer: TE Connectivity; Maximum Contact Resistance: 100mOhm; Mechanical Life: 100000Cycles; Bushing Type: Unthreaded; Switch Configuration: OFF(ON); Maximum DC Voltage Rating: 24V; Contact Rating @ Voltage: 0.05A@24VDC; Actuator Color: Black; Body Orientation: Straight; Function: MomentaryContact; Illumination: N/R; Actuator Style: RoundButton; Actuator Material: PolybutyleneTerephthalate; Dielectric Strength: 500VAC; Pole Throw Configuration: SPST; Actuator Length: 1.4mm; Product Weight: N/A; Contact Material: CopperAlloy; Housing Material: N/A; Terminal Type: PCPins; Minimum Insulation Resistance: 100MOhm; Package Description: 4-Pin Through Hole Device, Body 5.99 x 5.99 mm, Pitch 6.5 mm; Part No: 1825910-6; Package Reference: THD; Base Material: N/A; Manufacturer URL: http://www.te.com; Contact Plating: Silver; RoHS: Yes; Datasheet Version: Rev. C9; Electrical Life: 100000Cycles; Maximum AC Voltage Rating: N/A; Thread Size: N/R; Operating Temperature: -35to85C; Mounting: ThroughHole; Dimension: 5.99x5mm; Datasheet URL: http://www.te.com/commerce/DocumentDelivery/DDEController?Action=showdoc&DocId=Customer+Drawing%7F1825910%7FC9%7Fpdf%7FEnglish%7FENG_CD_1825910_C9.pdf%7F1825910-6; Family: 1825910; Seal Location: N/A; Seal Description: N/A; Packaging: N/A

## Nets that join several sheets
+5V: Connectors (J2.6), IN_12A (U3.5 U4.5 U5.5 U6.5), ATMega1284p (C19.2 C20.2 U7.10 U7.30), TPS5402 (C23.1 R10.2 U8.2)
+9V: Connectors (J1.1), TPS5402 (C22.2 U2#2.2)
GND: Connectors (J1.2 J1.3 J2.2), LTC3862-2 (30 pins), IN_12A (U3.12 U4.12 U5.12 U6.12), ATMega1284p (C19.1 C20.1 U7.11 U7.31), TPS5402 (9 pins), Buttons (SW1.1 SW2.1 SW3.1 SW4.1)
HV+: LTC3862-2 (10 pins), IN_12A (R12.2 R14.2 R15.2 R16.2)
NetJ2_1: Connectors (J2.1), ATMega1284p (U7.9)
NetJ2_3: Connectors (J2.3), ATMega1284p (U7.8)
NetJ2_4: Connectors (J2.4), ATMega1284p (U7.6)
NetJ2_5: Connectors (J2.5), ATMega1284p (U7.7)
NetSW1_3: ATMega1284p (U7.14), Buttons (SW1.3)
NetSW2_3: ATMega1284p (U7.15), Buttons (SW2.3)
NetSW3_3: ATMega1284p (U7.16), Buttons (SW3.3)
NetSW4_3: ATMega1284p (U7.17), Buttons (SW4.3)
NetU3_3: IN_12A (U3.3), ATMega1284p (U7.36)
NetU3_4: IN_12A (U3.4), ATMega1284p (U7.33)
NetU3_6: IN_12A (U3.6), ATMega1284p (U7.35)
NetU3_7: IN_12A (U3.7), ATMega1284p (U7.34)
NetU4_3: IN_12A (U4.3), ATMega1284p (U7.40)
NetU4_4: IN_12A (U4.4), ATMega1284p (U7.37)
NetU4_6: IN_12A (U4.6), ATMega1284p (U7.39)
NetU4_7: IN_12A (U4.7), ATMega1284p (U7.38)
NetU5_3: IN_12A (U5.3), ATMega1284p (U7.21)
NetU5_4: IN_12A (U5.4), ATMega1284p (U7.18)
NetU5_6: IN_12A (U5.6), ATMega1284p (U7.20)
NetU5_7: IN_12A (U5.7), ATMega1284p (U7.19)
NetU6_3: IN_12A (U6.3), ATMega1284p (U7.29)
NetU6_4: IN_12A (U6.4), ATMega1284p (U7.26)
NetU6_6: IN_12A (U6.6), ATMega1284p (U7.28)
NetU6_7: IN_12A (U6.7), ATMega1284p (U7.27)